# Altium project seven_segment_driver.PrjPCB
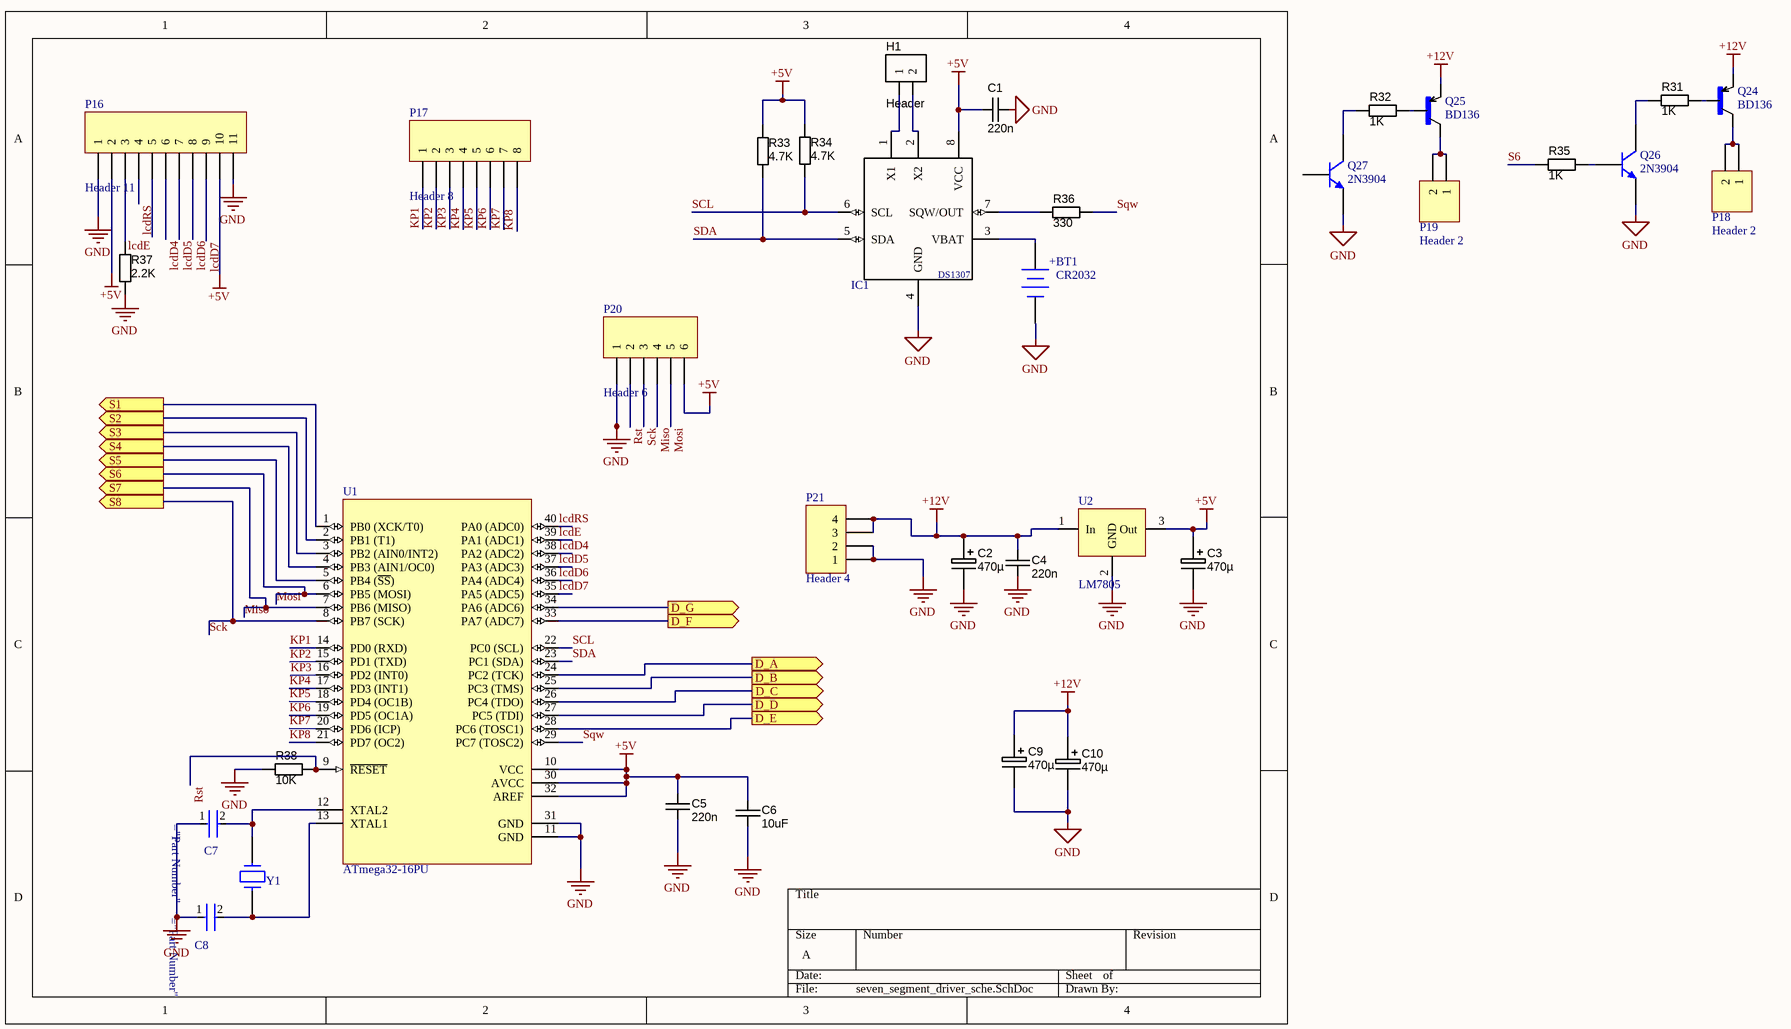
[diagram p0: seven_segment_driver_sche.SchDoc]
2 sheets, 102 parts. Net scope: flat (ports and power ports of the same name join across sheets).
Board file: seven_segment_driver_pcb.PcbDoc
Sheets:
  seven_segment_driver_sche.SchDoc
  seven_segment_driver_sche2.SchDoc

## Sheet seven_segment_driver_sche.SchDoc
size A

### Parts
BT1  CR2032  [CR2032 CELL HOLDER]
C1  value 220n  [CAPC500P450250X550]  (hidden comment: approved sub OK)
C2  470µ  [CAPE10.0MM_Rad_10x14mm]
C3  470µ  [CAPE10.0MM_Rad_10x14mm]
C4  value 220n  [CAPC500P450250X550]  (hidden comment: approved sub OK)
C5  value 220n  [CAPC500P450250X550]  (hidden comment: approved sub OK)
C6  value 10uF  [CAPE_5x11x2LS]  (hidden comment: approved sub OK)
C7  K220J15C0GF5TH5  [Vishay_K220J15_0]  (value not drawn)
C8  K220J15C0GF5TH5  [Vishay_K220J15_0]  (value not drawn)
C9  470µ  [CAPE10.0MM_Rad_10x14mm]
C10  470µ  [CAPE10.0MM_Rad_10x14mm]
H1  Header  [HDR_1x2_Offset]  (no BOM)
IC1  DS1307  [DIP8-300]  (value not drawn)
P16  Header 11  [HDR1X11]
P17  Header 8  [HDR1X8]
P18  Header 2  [HDR1X2]
P19  Header 2  [HDR1X2]
P20  Header 6  [HDR1X6]
P21  Header 4  [HDR1X4]
Q24  BD136  [*TO229P780X300X2000-3]
Q25  BD136  [*TO229P780X300X2000-3]
Q26  2N3904  [TO-92_Flat]
Q27  2N3904  [TO-92_Flat]
R31  value 1K  [RESTH_AXIAL-0.4]  (hidden comment: Carbon Film)
R32  value 1K  [RESTH_AXIAL-0.4]  (hidden comment: Carbon Film)
R33  value 4.7K  [RESTH_AXIAL-0.4]  (hidden comment: Carbon Film)
R34  value 4.7K  [RESTH_AXIAL-0.4]  (hidden comment: Carbon Film)
R35  value 1K  [RESTH_AXIAL-0.4]  (hidden comment: Carbon Film)
R36  value 330  [RESTH_AXIAL-0.4]  (hidden comment: Carbon Film)
R37  value 2.2K  [RESTH_AXIAL-0.4]  (hidden comment: Carbon Film)
R38  value 10K  [RESTH_AXIAL-0.4]  (hidden comment: Carbon Film)
U1  ATmega32-16PU  [40P6]
U2  LM7805  [To-254-AA]
Y1  4MHz  [Cristal mini]  (value not drawn)

### Ports
D_A (out), D_B (out), D_C (out), D_D (out), D_E (out), D_F (out), D_G (out), S1 (out), S2 (out), S3 (out), S4 (out), S5 (out), S6 (out), S7 (out), S8 (out)

### Nets
+5V: C1.1 C3.1 C5.1 C6.1 IC1.8(VCC) P16.2 P16.10 P20.6 R33.2 R34.2 U1.10(VCC) U1.30(AVCC) U1.32(AREF) U2.3(Out)
+12V: C2.1 C4.2 C9.1 C10.1 P21.3 P21.4 Q24.1(C) Q25.1(C) U2.1(In)
GND: BT1.2(-) C1.2 C2.2 C3.2 C4.1 C5.2 C6.2 C7.1 C8.1 C9.2 C10.2 IC1.4(GND) P16.1 P16.11 P20.1 P21.1 P21.2 Q26.1(E) Q27.1(E) R37.1 R38.1 U1.11(GND) U1.31(GND) U2.2(GND)
KP1: P17.1 U1.14(PD0_(RXD))
KP2: P17.2 U1.15(PD1_(TXD))
KP3: P17.3 U1.16(PD2_(INT0))
KP4: P17.4 U1.17(PD3_(INT1))
KP5: P17.5 U1.18(PD4_(OC1B))
KP6: P17.6 U1.19(PD5_(OC1A))
KP7: P17.7 U1.20(PD6_(ICP))
KP8: P17.8 U1.21(PD7_(OC2))
lcdD4: P16.6 U1.38(PA2_(ADC2))
lcdD5: P16.7 U1.37(PA3_(ADC3))
lcdD6: P16.8 U1.36(PA4_(ADC4))
lcdD7: P16.9 U1.35(PA5_(ADC5))
lcdE: P16.5 U1.39(PA1_(ADC1))
lcdRS: P16.4 U1.40(PA0_(ADC0))
Miso: P20.4 U1.7(PB6_(MISO)) ; port S7
Mosi: P20.5 U1.6(PB5_(MOSI)) ; port S6
Rst: P20.2 R38.2 U1.9(~{RESET})
S6: R35.1
Sck: P20.3 U1.8(PB7_(SCK)) ; port S8
SCL: IC1.6(SCL) R34.1 U1.22(PC0_(SCL))
SDA: IC1.5(SDA) R33.1 U1.23(PC1_(SDA))
Sqw: R36.2 U1.29(PC7_(TOSC2))
NetBT1_1: BT1.1(+) IC1.3(VBAT)
NetC7_2: C7.2 U1.12(XTAL2) Y1.2
NetC8_2: C8.2 U1.13(XTAL1) Y1.1
NetH1_1: H1.1 IC1.1(X1)
NetH1_2: H1.2 IC1.2(X2)
NetIC1_7: IC1.7(SQW/OUT) R36.1
NetP16_3: P16.3 R37.2
NetP18_1: P18.1 P18.2 Q24.2(C)
NetP19_1: P19.1 P19.2 Q25.2(C)
NetQ24_3: Q24.3(B) R31.2
NetQ25_3: Q25.3(B) R32.2
NetQ26_2: Q26.2(B) R35.2
NetQ26_3: Q26.3(C) R31.1
NetQ27_3: Q27.3(C) R32.1
NetR5_1: U1.2(PB1_(T1)) ; port S2
NetR6_1: U1.3(PB2_(AIN0/INT2)) ; port S3
NetR7_1: U1.1(PB0_(XCK/T0)) ; port S1
NetR8_1: U1.4(PB3_(AIN1/OC0)) ; port S4
NetR14_1: U1.5(PB4_(~{SS})) ; port S5
NetR23_1: U1.24(PC2_(TCK)) ; port D_A
NetR24_1: U1.27(PC5_(TDI)) ; port D_D
NetR25_1: U1.25(PC3_(TMS)) ; port D_B
NetR26_1: U1.26(PC4_(TDO)) ; port D_C
NetR27_1: U1.33(PA7_(ADC7)) ; port D_F
NetR28_1: U1.28(PC6_(TOSC1)) ; port D_E
NetR30_1: U1.34(PA6_(ADC6)) ; port D_G

Not connected (* = marked no-connect by the designer): Q27 2(B)

### Library data of the parts
BT1 = CR2032 Cell Holder: Revised: Zion Blue; Published: 06-May-2014; LatestRevisionDate: 17-Jul-2002; LatestRevisionNote: Re-released for DXP Platform.; Publisher: Cynetik Group
C1 C4-C6 = CAPR_220n_Radial_5mm: Capacitor Ceramic 220nF 10% 50V X7R radial 5mm lead spacing; Manufacturer 1: TDK Corporation; Manufacturer Part Number 1: FK24X7R1H224K; Ratings: 50V; X7R; SCDType: spec; Tolerance: ±10%; Material: ceramic; Supplier 1: Digi-Key; Supplier Part Number 1: 445-2855-ND; Package / Case: 0.217" L x 0.177" W (5.50mm x 4.50mm) radial 5mm LS; Operating Temperature: -55°C ~ 125°C; ComponentLink1URL: http://www.tdk.co.jp/tefe02/e4941_fk.pdf; ComponentLink1Description: e4941_fk datasheet
C2 C3 C9 C10 = CAPE_470u_16V_THT: Capacitor THT Alum Elec 470uF 20% 16V; Manufacturer 1: NICHICON; Manufacturer Part Number 1: UHM1C471MPD6; Ratings: 16V; 105°C; Material: Al Electrolytic; SCDType: undef; Package / Case: Radial; Tolerance: ±20%; Supplier 1: Newark; Supplier Part Number 1: 54K8151; Manufacturer 2: JD; Manufacturer Part Number 2: GT470UF16V_10x12mm; Value: 470µ
H1 = Header2P: Header, 2-pin
IC1 = DS1307: Ic Rtc Clk/Calendar I2c 8-Dip; MF: Maxim Integrated; Availability: Unavailable; SnapEDA_Link: https://www.snapeda.com/parts/DS1307/Maxim%20Integrated/view-part/?ref=snap; MP: DS1307; Price: None; Package: DIP-8 Maxim Integrated; Value: *
P16 = Header 11: Header, 11-Pin; LatestRevisionDate: 17-Jul-2002; LatestRevisionNote: Re-released for DXP Platform.; Publisher: Altium Limited
P17 = Header 8: Header, 8-Pin; LatestRevisionDate: 17-Jul-2002; LatestRevisionNote: Re-released for DXP Platform.; Publisher: Altium Limited
P18 P19 = Header 2: Header, 2-Pin; LatestRevisionDate: 17-Jul-2002; LatestRevisionNote: Re-released for DXP Platform.; Publisher: Altium Limited
P20 = Header 6: Header, 6-Pin; LatestRevisionDate: 17-Jul-2002; LatestRevisionNote: Re-released for DXP Platform.; Publisher: Altium Limited
P21 = Header 4: Header, 4-Pin; LatestRevisionDate: 17-Jul-2002; LatestRevisionNote: Re-released for DXP Platform.; Publisher: Altium Limited
Q26 Q27 = 2N3904: NPN General Purpose Amplifier; Published: 8-Jun-2000; LatestRevisionDate: 15-Jan-2003; LatestRevisionNote: PCB Footprint 'BCY-W3/D4.7' replaced; DatasheetVersion: 1997; PackageVersion: Sep-1998; PackageReference: TO-92A; Publisher: Altium Limited; PackageDescription: TO, Flat Index; 3 In-Line, Axial Leads; Body Dia. 4.5mm; Leads 0.51 x 0.48 mm (max); ComponentLink1Description: Manufacturer Link; ComponentLink1URL: http://www.fairchildsemi.com/; ComponentLink2Description: Datasheet; ComponentLink2URL: http://www.fairchildsemi.com/ds/2N%2F2N3904.pdf
R31-R38 = RES_1K_Axial_0.25W_5%: Resistor THD Axial 1k Ohm 0.25W 5% Carbon Film; Manufacturer 1: Yageo; Manufacturer Part Number 1: CFR-25JB-1K0; Ratings: 1/4W; SCDType: spec; Tolerance: ±5%; Package / Case: Axial; Supplier 1: Digi-Key; Supplier Part Number 1: 1.0KQBK-ND
U1 = ATmega32-16PU: 8-bit AVR Microcontroller, 4.5-5.5V, 16MHz, 32KB Flash, 1024 Bytes EEPROM, 2KB SRAM, 40-pin PDIP, Industrial Grade (-40°C to 85°C); DatasheetVersion: revQ, Feb-2011; PackageVersion: revB, Sep-2001; PackageReference: 40P6; PackageDescription: 40-lead (0.600"/15.24mm Wide) Plastic Dual Inline Package (PDIP); Code_JEDEC: MS-011-AC; ComponentLink1Description: Manufacturer URL; ComponentLink1URL: http://www.atmel.com/; ComponentLink2Description: ATmega32(L) Datasheet; ComponentLink2URL: http://atmel.com/dyn/resources/prod_documents/doc2503.pdf; ComponentLink3Description: ATmega32(L) Summary; ComponentLink3URL: http://atmel.com/dyn/resources/prod_documents/2503S.pdf
U2 = LM7805: IC REG LIN 5V 1A
Y1 = Quartz Crystal: Published: 8 April 2014; Created By: Zion Blue; Publisher: Cynetik Group; Nominal Fequency: 4MHz

## Sheet seven_segment_driver_sche2.SchDoc
size A
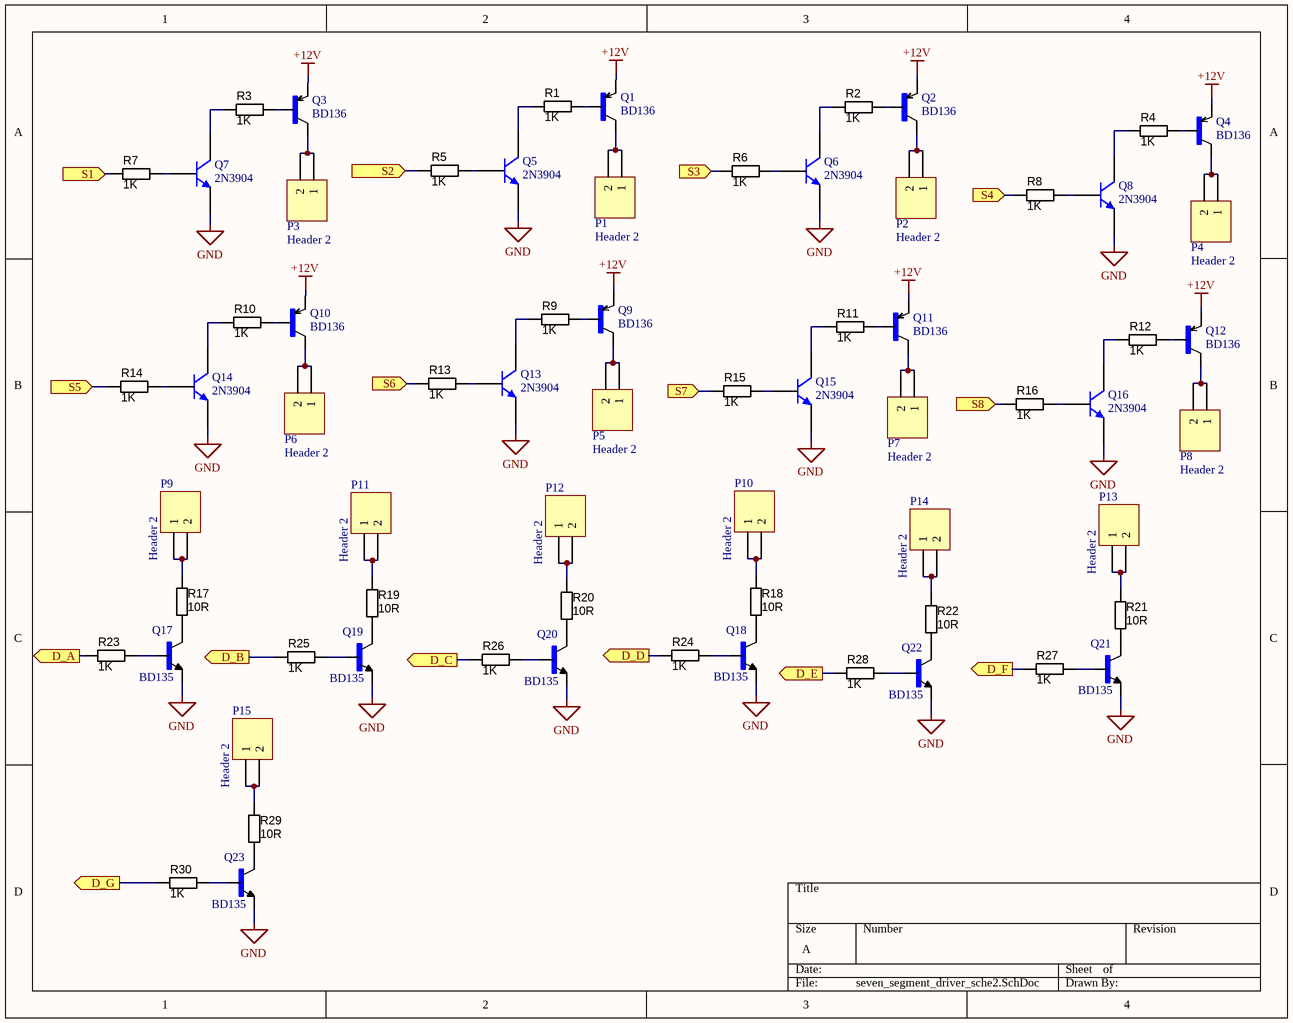
[diagram p1: seven_segment_driver_sche2.SchDoc]

### Parts
P1  Header 2  [HDR1X2]
P2  Header 2  [HDR1X2]
P3  Header 2  [HDR1X2]
P4  Header 2  [HDR1X2]
P5  Header 2  [HDR1X2]
P6  Header 2  [HDR1X2]
P7  Header 2  [HDR1X2]
P8  Header 2  [HDR1X2]
P9  Header 2  [HDR1X2]
P10  Header 2  [HDR1X2]
P11  Header 2  [HDR1X2]
P12  Header 2  [HDR1X2]
P13  Header 2  [HDR1X2]
P14  Header 2  [HDR1X2]
P15  Header 2  [HDR1X2]
Q1  BD136  [*TO229P780X300X2000-3]
Q2  BD136  [*TO229P780X300X2000-3]
Q3  BD136  [*TO229P780X300X2000-3]
Q4  BD136  [*TO229P780X300X2000-3]
Q5  2N3904  [TO-92_Flat]
Q6  2N3904  [TO-92_Flat]
Q7  2N3904  [TO-92_Flat]
Q8  2N3904  [TO-92_Flat]
Q9  BD136  [*TO229P780X300X2000-3]
Q10  BD136  [*TO229P780X300X2000-3]
Q11  BD136  [*TO229P780X300X2000-3]
Q12  BD136  [*TO229P780X300X2000-3]
Q13  2N3904  [TO-92_Flat]
Q14  2N3904  [TO-92_Flat]
Q15  2N3904  [TO-92_Flat]
Q16  2N3904  [TO-92_Flat]
Q17  BD135  [*TO229P780X300X2000-3]
Q18  BD135  [*TO229P780X300X2000-3]
Q19  BD135  [*TO229P780X300X2000-3]
Q20  BD135  [*TO229P780X300X2000-3]
Q21  BD135  [*TO229P780X300X2000-3]
Q22  BD135  [*TO229P780X300X2000-3]
Q23  BD135  [*TO229P780X300X2000-3]
R1  value 1K  [RESTH_AXIAL-0.4]  (hidden comment: Carbon Film)
R2  value 1K  [RESTH_AXIAL-0.4]  (hidden comment: Carbon Film)
R3  value 1K  [RESTH_AXIAL-0.4]  (hidden comment: Carbon Film)
R4  value 1K  [RESTH_AXIAL-0.4]  (hidden comment: Carbon Film)
R5  value 1K  [RESTH_AXIAL-0.4]  (hidden comment: Carbon Film)
R6  value 1K  [RESTH_AXIAL-0.4]  (hidden comment: Carbon Film)
R7  value 1K  [RESTH_AXIAL-0.4]  (hidden comment: Carbon Film)
R8  value 1K  [RESTH_AXIAL-0.4]  (hidden comment: Carbon Film)
R9  value 1K  [RESTH_AXIAL-0.4]  (hidden comment: Carbon Film)
R10  value 1K  [RESTH_AXIAL-0.4]  (hidden comment: Carbon Film)
R11  value 1K  [RESTH_AXIAL-0.4]  (hidden comment: Carbon Film)
R12  value 1K  [RESTH_AXIAL-0.4]  (hidden comment: Carbon Film)
R13  value 1K  [RESTH_AXIAL-0.4]  (hidden comment: Carbon Film)
R14  value 1K  [RESTH_AXIAL-0.4]  (hidden comment: Carbon Film)
R15  value 1K  [RESTH_AXIAL-0.4]  (hidden comment: Carbon Film)
R16  value 1K  [RESTH_AXIAL-0.4]  (hidden comment: Carbon Film)
R17  value 10R  [AXIAL-0.6]  (hidden comment: Metal Film)
R18  value 10R  [AXIAL-0.6]  (hidden comment: Metal Film)
R19  value 10R  [AXIAL-0.6]  (hidden comment: Metal Film)
R20  value 10R  [AXIAL-0.6]  (hidden comment: Metal Film)
R21  value 10R  [AXIAL-0.6]  (hidden comment: Metal Film)
R22  value 10R  [AXIAL-0.6]  (hidden comment: Metal Film)
R23  value 1K  [RESTH_AXIAL-0.4]  (hidden comment: Carbon Film)
R24  value 1K  [RESTH_AXIAL-0.4]  (hidden comment: Carbon Film)
R25  value 1K  [RESTH_AXIAL-0.4]  (hidden comment: Carbon Film)
R26  value 1K  [RESTH_AXIAL-0.4]  (hidden comment: Carbon Film)
R27  value 1K  [RESTH_AXIAL-0.4]  (hidden comment: Carbon Film)
R28  value 1K  [RESTH_AXIAL-0.4]  (hidden comment: Carbon Film)
R29  value 10R  [AXIAL-0.6]  (hidden comment: Metal Film)
R30  value 1K  [RESTH_AXIAL-0.4]  (hidden comment: Carbon Film)

### Ports
D_A (out), D_B (out), D_C (out), D_D (out), D_E (out), D_F (out), D_G (out), S1 (in), S2 (in), S3 (in), S4 (in), S5 (in), S6 (in), S7 (in), S8 (in)

### Nets
+12V: Q1.1(C) Q2.1(C) Q3.1(C) Q4.1(C) Q9.1(C) Q10.1(C) Q11.1(C) Q12.1(C)
GND: Q5.1(E) Q6.1(E) Q7.1(E) Q8.1(E) Q13.1(E) Q14.1(E) Q15.1(E) Q16.1(E) Q17.1(E) Q18.1(E) Q19.1(E) Q20.1(E) Q21.1(E) Q22.1(E) Q23.1(E)
Miso: R15.1 ; port S7
Mosi: R13.1 ; port S6
Sck: R16.1 ; port S8
NetP1_1: P1.1 P1.2 Q1.2(C)
NetP2_1: P2.1 P2.2 Q2.2(C)
NetP3_1: P3.1 P3.2 Q3.2(C)
NetP4_1: P4.1 P4.2 Q4.2(C)
NetP5_1: P5.1 P5.2 Q9.2(C)
NetP6_1: P6.1 P6.2 Q10.2(C)
NetP7_1: P7.1 P7.2 Q11.2(C)
NetP8_1: P8.1 P8.2 Q12.2(C)
NetP9_1: P9.1 P9.2 R17.1
NetP10_1: P10.1 P10.2 R18.1
NetP11_1: P11.1 P11.2 R19.1
NetP12_1: P12.1 P12.2 R20.1
NetP13_1: P13.1 P13.2 R21.1
NetP14_1: P14.1 P14.2 R22.1
NetP15_1: P15.1 P15.2 R29.1
NetQ1_3: Q1.3(B) R1.2
NetQ2_3: Q2.3(B) R2.2
NetQ3_3: Q3.3(B) R3.2
NetQ4_3: Q4.3(B) R4.2
NetQ5_2: Q5.2(B) R5.2
NetQ5_3: Q5.3(C) R1.1
NetQ6_2: Q6.2(B) R6.2
NetQ6_3: Q6.3(C) R2.1
NetQ7_2: Q7.2(B) R7.2
NetQ7_3: Q7.3(C) R3.1
NetQ8_2: Q8.2(B) R8.2
NetQ8_3: Q8.3(C) R4.1
NetQ9_3: Q9.3(B) R9.2
NetQ10_3: Q10.3(B) R10.2
NetQ11_3: Q11.3(B) R11.2
NetQ12_3: Q12.3(B) R12.2
NetQ13_2: Q13.2(B) R13.2
NetQ13_3: Q13.3(C) R9.1
NetQ14_2: Q14.2(B) R14.2
NetQ14_3: Q14.3(C) R10.1
NetQ15_2: Q15.2(B) R15.2
NetQ15_3: Q15.3(C) R11.1
NetQ16_2: Q16.2(B) R16.2
NetQ16_3: Q16.3(C) R12.1
NetQ17_2: Q17.2(C) R17.2
NetQ17_3: Q17.3(B) R23.2
NetQ18_2: Q18.2(C) R18.2
NetQ18_3: Q18.3(B) R24.2
NetQ19_2: Q19.2(C) R19.2
NetQ19_3: Q19.3(B) R25.2
NetQ20_2: Q20.2(C) R20.2
NetQ20_3: Q20.3(B) R26.2
NetQ21_2: Q21.2(C) R21.2
NetQ21_3: Q21.3(B) R27.2
NetQ22_2: Q22.2(C) R22.2
NetQ22_3: Q22.3(B) R28.2
NetQ23_2: Q23.2(C) R29.2
NetQ23_3: Q23.3(B) R30.2
NetR5_1: R5.1 ; port S2
NetR6_1: R6.1 ; port S3
NetR7_1: R7.1 ; port S1
NetR8_1: R8.1 ; port S4
NetR14_1: R14.1 ; port S5
NetR23_1: R23.1 ; port D_A
NetR24_1: R24.1 ; port D_D
NetR25_1: R25.1 ; port D_B
NetR26_1: R26.1 ; port D_C
NetR27_1: R27.1 ; port D_F
NetR28_1: R28.1 ; port D_E
NetR30_1: R30.1 ; port D_G

### Library data of the parts
P1-P15 = Header 2: Header, 2-Pin; LatestRevisionDate: 17-Jul-2002; LatestRevisionNote: Re-released for DXP Platform.; Publisher: Altium Limited
Q5-Q8 Q13-Q16 = 2N3904: NPN General Purpose Amplifier; Published: 8-Jun-2000; LatestRevisionDate: 15-Jan-2003; LatestRevisionNote: PCB Footprint 'BCY-W3/D4.7' replaced; DatasheetVersion: 1997; PackageVersion: Sep-1998; PackageReference: TO-92A; Publisher: Altium Limited; PackageDescription: TO, Flat Index; 3 In-Line, Axial Leads; Body Dia. 4.5mm; Leads 0.51 x 0.48 mm (max); ComponentLink1Description: Manufacturer Link; ComponentLink1URL: http://www.fairchildsemi.com/; ComponentLink2Description: Datasheet; ComponentLink2URL: http://www.fairchildsemi.com/ds/2N%2F2N3904.pdf
Q17-Q23 = BD135: Trans GP BJT NPN 45V 1.5A 3-Pin TO-126; MF: ON Semiconductor; SnapEDA_Link: https://www.snapeda.com/parts/BD135/ON%20Semiconductor/view-part/?ref=snap; Price: None; MP: BD135; Availability: Unavailable; Package: TO-126-3 NXP Semiconductors; Value: *
R1-R16 R23-R28 R30 = RES_1K_Axial_0.25W_5%: as R31 on sheet seven_segment_driver_sche; Tolerance: ±5%; Package / Case: Axial; Supplier 1: Digi-Key; Supplier Part Number 1: 1.0KQBK-ND
R17-R22 R29 = RES_10R_Axial_1W_5%: Resistor THD 10 Ohm 1W 5% Metal Film; Manufacturer 1: Vishay/BC Components; Manufacturer Part Number 1: PR01000101009JR500; SCDType: spec; Tolerance: ±5%; Package / Case: 2.5x8.0mm DxL; Ratings: 1W; Supplier 1: Digi-Key; Supplier Part Number 1: PPC10W-1CT-ND

## Nets that join several sheets
+12V: seven_segment_driver_sche (9 pins), seven_segment_driver_sche2 (8 pins)
GND: seven_segment_driver_sche (24 pins), seven_segment_driver_sche2 (15 pins)
Miso: seven_segment_driver_sche (P20.4 U1.7), seven_segment_driver_sche2 (R15.1)
Mosi: seven_segment_driver_sche (P20.5 U1.6), seven_segment_driver_sche2 (R13.1)
NetR5_1: seven_segment_driver_sche (U1.2), seven_segment_driver_sche2 (R5.1)
NetR6_1: seven_segment_driver_sche (U1.3), seven_segment_driver_sche2 (R6.1)
NetR7_1: seven_segment_driver_sche (U1.1), seven_segment_driver_sche2 (R7.1)
NetR8_1: seven_segment_driver_sche (U1.4), seven_segment_driver_sche2 (R8.1)
NetR14_1: seven_segment_driver_sche (U1.5), seven_segment_driver_sche2 (R14.1)
NetR23_1: seven_segment_driver_sche (U1.24), seven_segment_driver_sche2 (R23.1)
NetR24_1: seven_segment_driver_sche (U1.27), seven_segment_driver_sche2 (R24.1)
NetR25_1: seven_segment_driver_sche (U1.25), seven_segment_driver_sche2 (R25.1)
NetR26_1: seven_segment_driver_sche (U1.26), seven_segment_driver_sche2 (R26.1)
NetR27_1: seven_segment_driver_sche (U1.33), seven_segment_driver_sche2 (R27.1)
NetR28_1: seven_segment_driver_sche (U1.28), seven_segment_driver_sche2 (R28.1)
NetR30_1: seven_segment_driver_sche (U1.34), seven_segment_driver_sche2 (R30.1)
Sck: seven_segment_driver_sche (P20.3 U1.8), seven_segment_driver_sche2 (R16.1)